# Altium schematic sheet OUTPUT.SchDoc: OUTPUT BLOCK
size 180 x 80 mm; Revision: 1
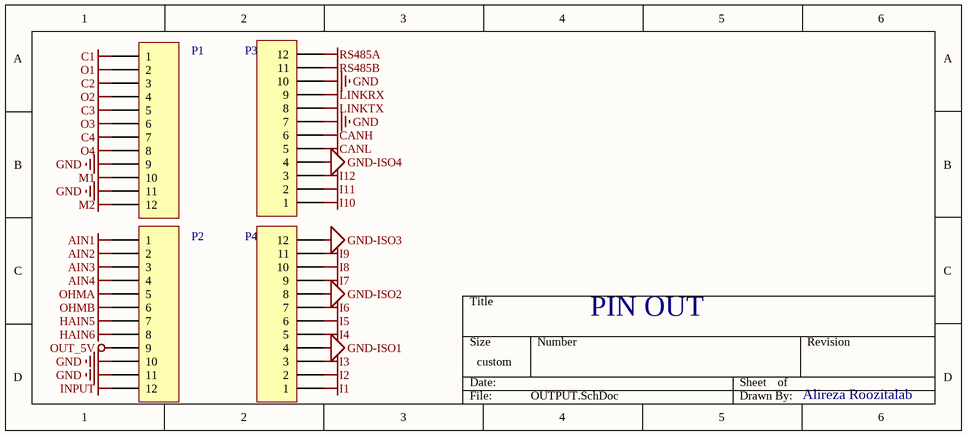
[diagram p0: OUTPUT.SchDoc]

## Parts
P1  MHDR1X12  [W23112R5MILH]  (value not drawn)
P2  MHDR1X12  [W23112R5MILH]  (value not drawn)
P3  MHDR1X12  [W23112R5MILH]  (value not drawn)
P4  MHDR1X12  [W23112R5MILH]  (value not drawn)

## Nets
AIN1: P2.1
AIN2: P2.2
AIN3: P2.3
AIN4: P2.4
C1: P1.1
C2: P1.3
C3: P1.5
C4: P1.7
CANH: P3.6
CANL: P3.5
GND: P1.9 P1.11 P2.10 P2.11 P3.7 P3.10
GND-ISO1: P4.4
GND-ISO2: P4.8
GND-ISO3: P4.12
GND-ISO4: P3.4
HAIN5: P2.7
HAIN6: P2.8
I1: P4.1
I2: P4.2
I3: P4.3
I4: P4.5
I5: P4.6
I6: P4.7
I7: P4.9
I8: P4.10
I9: P4.11
I10: P3.1
I11: P3.2
I12: P3.3
INPUT: P2.12
LINKRX: P3.9
LINKTX: P3.8
M1: P1.10
M2: P1.12
O1: P1.2
O2: P1.4
O3: P1.6
O4: P1.8
OHMA: P2.5
OHMB: P2.6
OUT_5V: P2.9
RS485A: P3.12
RS485B: P3.11

## Notes on the sheet
- PIN OUT
- Alireza Roozitalab

## Library data of the parts
P1-P4 = MHDR1X12: Header, 12-Pin; LatestRevisionDate: 17-Jul-2002; LatestRevisionNote: Re-released for DXP Platform.; Publisher: Altium Limited